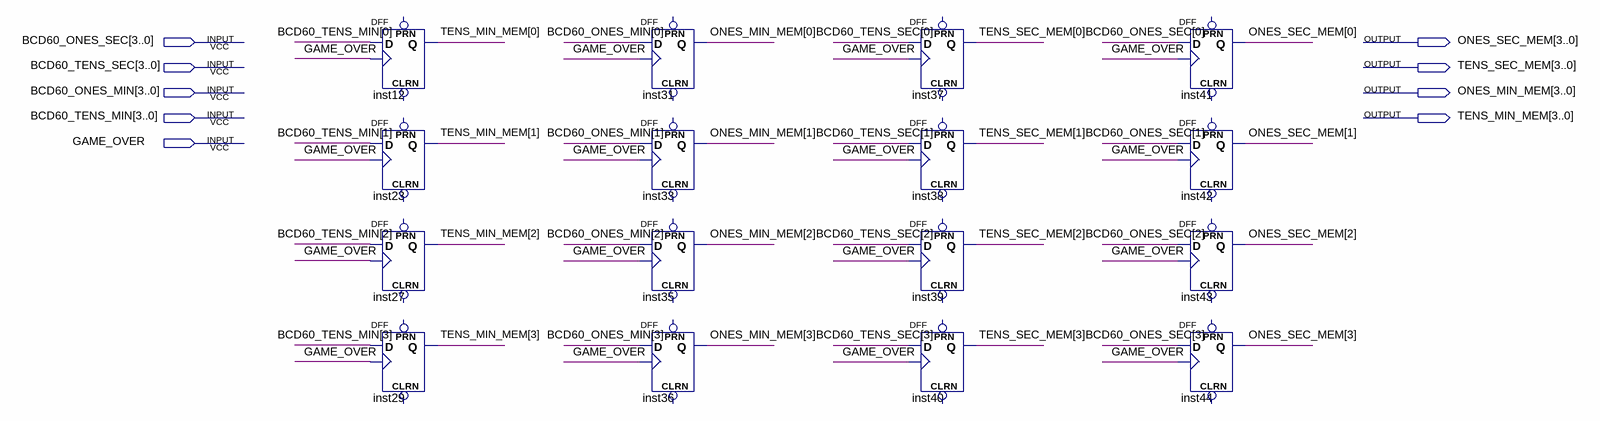
[diagram p0: schematic sheet]
// Quartus schematic Memory.bdf as structural Verilog: 16 symbols, 9 pins
module Memory (
  input  [3:0] BCD60_ONES_SEC,
  input  [3:0] BCD60_TENS_SEC,
  input  [3:0] BCD60_ONES_MIN,
  input  [3:0] BCD60_TENS_MIN,
  input  GAME_OVER,
  output [3:0] ONES_SEC_MEM,
  output [3:0] TENS_SEC_MEM,
  output [3:0] ONES_MIN_MEM,
  output [3:0] TENS_MIN_MEM
);

  DFF inst12 (.CLK(GAME_OVER), .D(BCD60_TENS_MIN[0]), .Q(TENS_MIN_MEM[0]));  // open: CLRN, PRN
  DFF inst23 (.CLK(GAME_OVER), .D(BCD60_TENS_MIN[1]), .Q(TENS_MIN_MEM[1]));  // open: CLRN, PRN
  DFF inst27 (.CLK(GAME_OVER), .D(BCD60_TENS_MIN[2]), .Q(TENS_MIN_MEM[2]));  // open: CLRN, PRN
  DFF inst29 (.CLK(GAME_OVER), .D(BCD60_TENS_MIN[3]), .Q(TENS_MIN_MEM[3]));  // open: CLRN, PRN
  DFF inst31 (.CLK(GAME_OVER), .D(BCD60_ONES_MIN[0]), .Q(ONES_MIN_MEM[0]));  // open: CLRN, PRN
  DFF inst33 (.CLK(GAME_OVER), .D(BCD60_ONES_MIN[1]), .Q(ONES_MIN_MEM[1]));  // open: CLRN, PRN
  DFF inst35 (.CLK(GAME_OVER), .D(BCD60_ONES_MIN[2]), .Q(ONES_MIN_MEM[2]));  // open: CLRN, PRN
  DFF inst36 (.CLK(GAME_OVER), .D(BCD60_ONES_MIN[3]), .Q(ONES_MIN_MEM[3]));  // open: CLRN, PRN
  DFF inst37 (.CLK(GAME_OVER), .D(BCD60_TENS_SEC[0]), .Q(TENS_SEC_MEM[0]));  // open: CLRN, PRN
  DFF inst38 (.CLK(GAME_OVER), .D(BCD60_TENS_SEC[1]), .Q(TENS_SEC_MEM[1]));  // open: CLRN, PRN
  DFF inst39 (.CLK(GAME_OVER), .D(BCD60_TENS_SEC[2]), .Q(TENS_SEC_MEM[2]));  // open: CLRN, PRN
  DFF inst40 (.CLK(GAME_OVER), .D(BCD60_TENS_SEC[3]), .Q(TENS_SEC_MEM[3]));  // open: CLRN, PRN
  DFF inst41 (.CLK(GAME_OVER), .D(BCD60_ONES_SEC[0]), .Q(ONES_SEC_MEM[0]));  // open: CLRN, PRN
  DFF inst42 (.CLK(GAME_OVER), .D(BCD60_ONES_SEC[1]), .Q(ONES_SEC_MEM[1]));  // open: CLRN, PRN
  DFF inst43 (.CLK(GAME_OVER), .D(BCD60_ONES_SEC[2]), .Q(ONES_SEC_MEM[2]));  // open: CLRN, PRN
  DFF inst44 (.CLK(GAME_OVER), .D(BCD60_ONES_SEC[3]), .Q(ONES_SEC_MEM[3]));  // open: CLRN, PRN
endmodule
